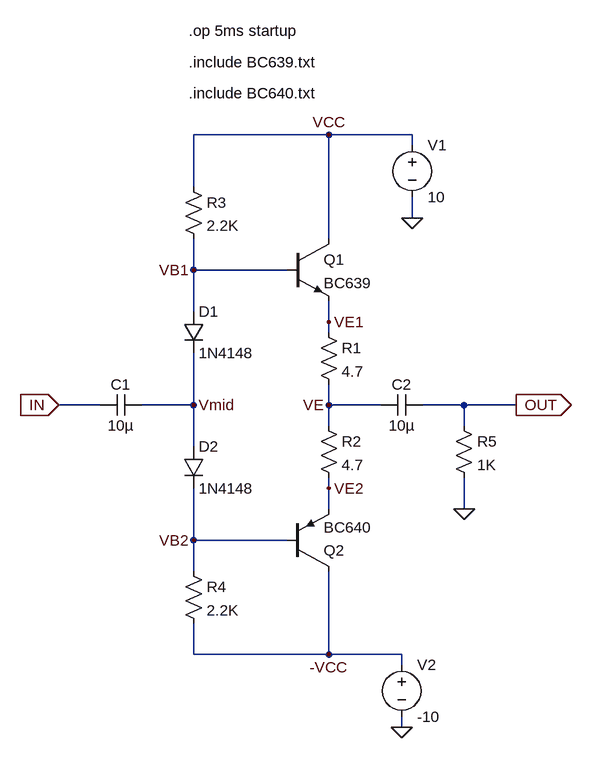
[diagram p0: schematic Simulation3 DC_Analysis.asc]
Simulation3 DC_Analysis.asc, the LTspice schematic file:
Version 4
SHEET 1 5568 872
WIRE 256 -160 48 -160
WIRE 384 -160 256 -160
WIRE 384 -144 384 -160
WIRE 48 -80 48 -160
WIRE 384 -32 384 -64
WIRE 256 0 256 -160
WIRE 48 48 48 0
WIRE 192 48 48 48
WIRE 48 112 48 48
WIRE 256 128 256 96
WIRE 256 144 256 128
WIRE -96 256 -160 256
WIRE 48 256 48 176
WIRE 48 256 -32 256
WIRE 256 256 256 224
WIRE 336 256 256 256
WIRE 464 256 400 256
WIRE 544 256 464 256
WIRE 256 288 256 256
WIRE 464 288 464 256
WIRE 48 320 48 256
WIRE 256 384 256 368
WIRE 256 416 256 384
WIRE 464 416 464 368
WIRE 48 464 48 384
WIRE 192 464 48 464
WIRE 48 512 48 464
WIRE 48 640 48 592
WIRE 256 640 256 512
WIRE 256 640 48 640
WIRE 368 640 256 640
WIRE 368 656 368 640
WIRE 368 752 368 736
FLAG 464 416 0
FLAG 384 -32 0
FLAG 368 752 0
FLAG 48 48 VB1
FLAG 48 464 VB2
FLAG 256 256 VE
FLAG 256 -160 VCC
FLAG 256 640 -VCC
FLAG 256 128 VE1
FLAG 256 384 VE2
FLAG 48 256 Vmid
FLAG -160 256 IN
IOPIN -160 256 In
FLAG 544 256 OUT
IOPIN 544 256 Out
SYMBOL res 32 -96 R0
SYMATTR InstName R3
SYMATTR Value 2.2K
SYMBOL res 32 496 R0
SYMATTR InstName R4
SYMATTR Value 2.2K
SYMBOL res 240 272 R0
SYMATTR InstName R2
SYMATTR Value 4.7
SYMBOL res 240 128 R0
SYMATTR InstName R1
SYMATTR Value 4.7
SYMBOL res 448 272 R0
SYMATTR InstName R5
SYMATTR Value 1K
SYMBOL cap -32 240 R90
WINDOW 0 0 32 VBottom 2
WINDOW 3 32 32 VTop 2
SYMATTR InstName C1
SYMATTR Value 10µ
SYMBOL cap 400 240 R90
WINDOW 0 0 32 VBottom 2
WINDOW 3 32 32 VTop 2
SYMATTR InstName C2
SYMATTR Value 10µ
SYMBOL diode 32 112 R0
SYMATTR InstName D1
SYMATTR Value 1N4148
SYMBOL diode 32 320 R0
SYMATTR InstName D2
SYMATTR Value 1N4148
SYMBOL npn 192 0 R0
SYMATTR InstName Q1
SYMATTR Value BC639
SYMBOL voltage 384 -160 R0
WINDOW 123 0 0 Left 0
WINDOW 39 0 0 Left 0
SYMATTR InstName V1
SYMATTR Value 10
SYMBOL voltage 368 640 R0
WINDOW 123 0 0 Left 0
WINDOW 39 0 0 Left 0
SYMATTR InstName V2
SYMATTR Value -10
SYMBOL pnp 192 512 M180
SYMATTR InstName Q2
SYMATTR Value BC640
TEXT 40 -320 Left 2 !.op 5ms startup
TEXT 40 -272 Left 2 !.include BC639.txt
TEXT 40 -224 Left 2 !.include BC640.txt

The netlist it stands for:
* Simulation3 DC_Analysis.asc
R3 VCC VB1 2.2K
R4 VB2 -VCC 2.2K
R2 VE VE2 4.7
R1 VE1 VE 4.7
R5 OUT 0 1K
C1 Vmid IN 10µ
C2 OUT VE 10µ
D1 VB1 Vmid 1N4148
D2 Vmid VB2 1N4148
Q1 VCC VB1 VE1 0 BC639
V1 VCC 0 10
V2 -VCC 0 -10
Q2 -VCC VB2 VE2 0 BC640
.model D D
.lib standard.dio
.model NPN NPN
.model PNP PNP
.lib standard.bjt
.op 5ms startup
.include BC639.txt
.include BC640.txt
.backanno
.end